# EAGLE design usbswitch (EAGLE 6.2)
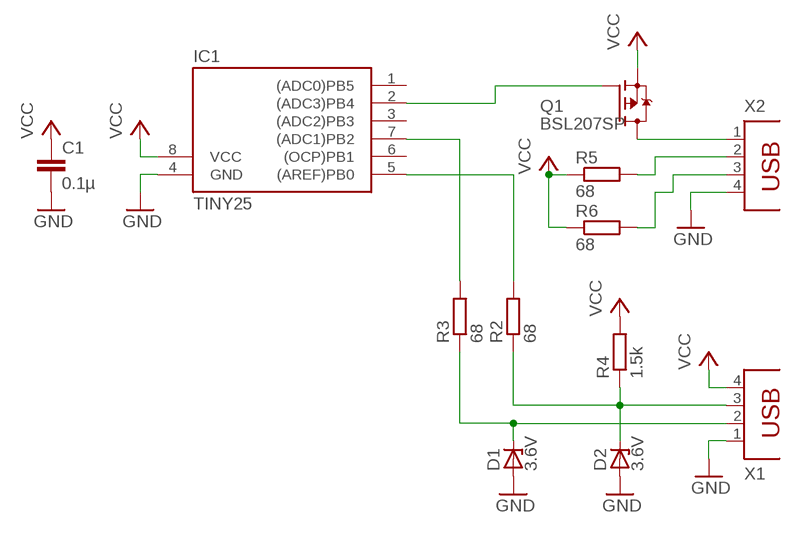
[diagram p0: schematic, sheet 1]

## Parts
C1  0.1µ  C-EUC1206  [C1206]
D1  3.6V  ZENER-DIODESOD80C  [SOD80C]
D2  3.6V  ZENER-DIODESOD80C  [SOD80C]
IC1  TINY25  TINY15LS  [SOIC8]
Q1  BSL207SP  [SOT23]
R2  68  R-EU_R1206  [R1206]
R3  68  R-EU_R1206  [R1206]
R4  1.5k  R-EU_R1206  [R1206]
R5  68  R-EU_R1206  [R1206@1]
R6  68  R-EU_R1206  [R1206]
X1  PN87520  [PN87520]
X2  PN87520  [PN87520]

## Nets
GND: C1.2 D1.A D2.A IC1.4(GND) X1.1 X2.4
N$1: IC1.2((ADC3)PB4) Q1.1(G)
N$2: Q1.3(D) X2.1
N$3: R5.2 X2.2
N$4: D2.C R2.1 R4.1 X1.3
N$5: D1.C R3.1 X1.2
N$6: IC1.5((AREF)PB0) R2.2
N$7: IC1.7((ADC1)PB2) R3.2
N$8: R6.2 X2.3
VCC: C1.1 IC1.8(VCC) Q1.2(S) R4.2 R5.1 R6.1 X1.4
Unconnected: IC1.1((ADC0)PB5) IC1.3((ADC2)PB3) IC1.6((OCP)PB1)

## Library data of the parts
C1 = resistor:C-EU: CAPACITOR, European symbol
D1 D2 = diode:ZENER-DIODE: Z-Diode
IC1 = atmel:TINY15L: MICROCONTROLLER 2.7 V 1 Kbytes FLASH 64 bytes EEPROM 4-channel 10 bit ADC; OC_FARNELL: unknown; OC_NEWARK: unknown
Q1 = irf:BSL207SP: OptiMOS(R)-P Small-Signal-Transistor P-Channel, Enhancement mode, Super Logic Level (2.5 V rated) Source: http://www.infineon.com/upload/Document/BSL207SP_Rev2.01.pdf
R2-R4 R6 = rcl:R-EU_: RESISTOR, European symbol
R5 = resistor:R-EU_: RESISTOR, European symbol
X1 X2 = con-berg:PN87520: BERG USB connector; OC_FARNELL: unknown; OC_NEWARK: unknown

## Board
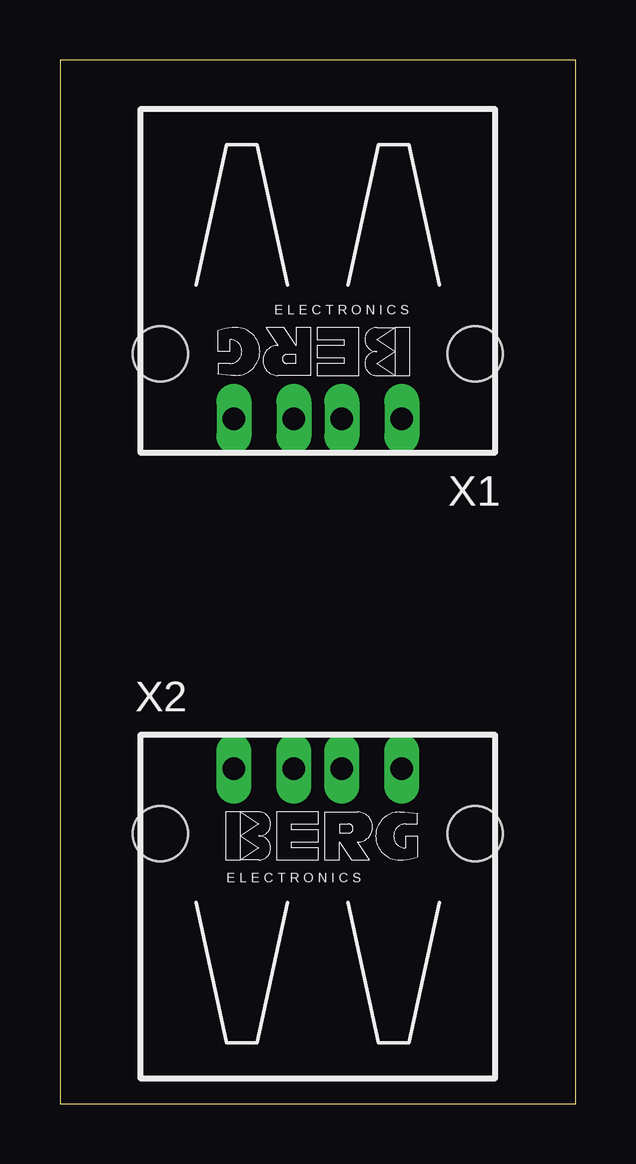
[diagram p1: board, top side]
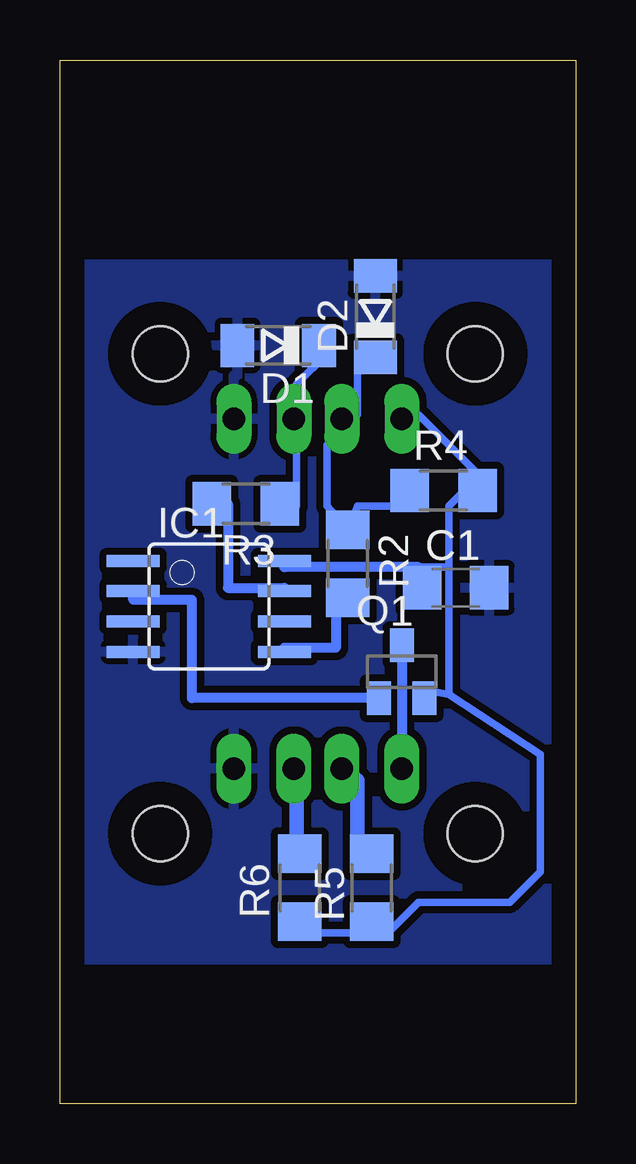
[diagram p2: board, bottom side, seen from below]

Size 21.5 x 43.5 mm. Coordinates in mm from the lower left corner, seen from the top.
Outline: 0,0 21.5,0 21.5,43.5 0,43.5 0,0
Copper layers (1*16): Top 0.035mm / dielectric 1.5mm / Bottom 0.035mm
Design rules: minimum track width 12mil, minimum drill 10mil, track to track 12mil, track to pad 12mil, pad to pad 12mil, via to via 12mil, smd to smd 12mil, copper to edge 40mil, drill to drill 12mil, minimum pad ring 10mil, minimum via ring 8mil, stop-mask expansion 4mil, vias tented up to drill 0mil, thermal gap 10mil

### Footprints (pad centres in the part's own frame; a part is rotated, then mirrored left to right if it is on the bottom)
C1206 = smd 1.6 x 1.8: 1 -1.4,0; 2 1.4,0
SOD80C = smd 1.4 x 1.8: A 1.7,0; C -1.7,0
SOIC8 = smd 0.5 x 2.2: 1 -1.905,-3.154; 2 -0.645,-3.154; 3 0.625,-3.154; 4 1.895,-3.154; 5 1.905,3.154; 6 0.635,3.154; 7 -0.635,3.154; 8 -1.905,3.154
SOT23 = smd 1 x 1.4: 1 -0.95,-1.1; 2 0.95,-1.1; 3 0,1.1
R1206 = smd 1.6 x 1.803: 1 -1.422,0; 2 1.422,0
PN87520 = drill 0.95 long: 1 -3.5,2.71; 2 -1,2.71; 3 1,2.71; 4 3.5,2.71 | hole 2.3: -6.57,0; 6.57,0

### Placement (x,y rotation side)
C1  5,21.5 0 bottom
D1  12.4,31.6 180 bottom
D2  8.35,32.8 90 bottom
IC1  15.29,20.72 270 bottom
Q1  7.25,18 0 bottom
R2  9.5,22.5 270 bottom
R3  13.75,25 180 bottom
R4  5.5,25.55 0 bottom
R5  68  [R1206]  8.5,9 90 bottom
R6  11.5,9 90 bottom
X1  10.75,31.25 180 top
X2  10.75,11.25 0 top

### Tracks (layer width: path | path; a pad name or v marks a point on that pad's centre or on a via)
GND
  Bottom 0.305: 14.17,31.25 D1.A
  pour Bottom: 1,6 20.5,6 20.5,35 1,35
N$1
  Bottom 0.406: Q1.1 16,16.9 16,21 18.44,21 IC1.2
N$2
  Bottom 0.406: Q1.3 X2.1
N$3
  Bottom 0.305: 9.09,10.93 R5.2
  Bottom 0.61: 9.09,10.93 9.09,13.47 X2.2
N$4
  Bottom 0.305: R4.1 6.55,24.9 9.09,24.9 R2.1 10.36,24.9 10.36,27.44 X1.3 9.09,28.71 9.09,31.25 D2.C
N$5
  Bottom 0.305: D1.C 10.36,31.25 11.63,29.98 11.63,28.71 X1.2 11.63,27.44 11.63,24.9 R3.1
N$6
  Bottom 0.406: R2.2 10,21.58 10,19 12.14,19 IC1.5
N$7
  Bottom 0.406: R3.2 14.5,25 14.5,21.5 12.14,21.5 IC1.7
N$8
  Bottom 0.305: 11.63,10.93 R6.2
  Bottom 0.61: 11.63,10.93 11.63,13.47 X2.3
VCC
  Bottom 0.305: R6.1 11.63,7.12 9.09,7.12 R5.1 7.82,7.12 6.55,8.39 2.74,8.39 1.47,9.66 1.47,14.55 5.28,17.05 | 5.28,17.05 6.55,17.28 Q1.2 | 5.28,22.36 5.28,17.05 | 5.28,22.36 6.55,22.36 C1.1 | 4.01,26.17 6.55,28.71 X1.4 | 4.01,26.17 5.28,24.9 5.28,22.36 | 4.01,26.17 R4.2
  Bottom 0.406: 6.55,22.36 12.14,22.36 IC1.8 12,22.62 12,22.5 11.5,22.5